# EAGLE board DingDingMusicCircuitBoard 1.0 (EAGLE 7.3.0), part 1 of 2
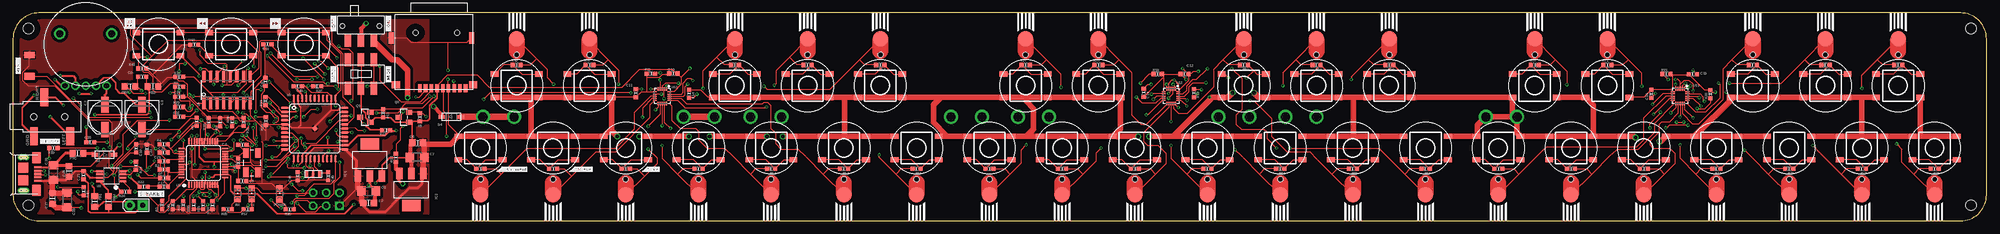
[diagram p4: board, top side]
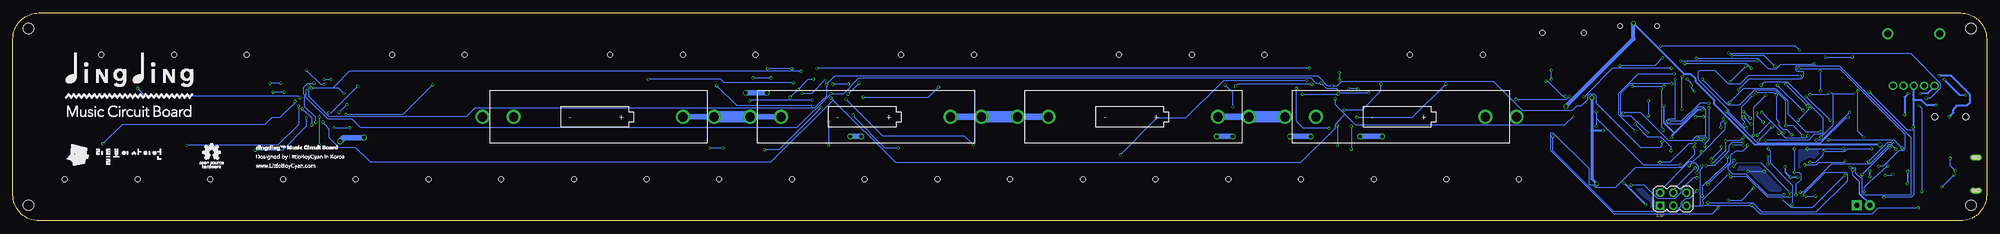
[diagram p5: board, bottom side, seen from below]

Size 380 x 40 mm. Coordinates in mm from the lower left corner, seen from the top.
Outline: 5,0 375,0 arc90 380,5 380,35 arc90 375,40 5,40 arc90 0,35 0,5 arc90 5,0
Copper layers (1*16): Top 0.035mm / dielectric 1.5mm / Bottom 0.035mm
Design rules "SparkFun *": minimum track width 5mil, minimum drill 12mil, track to track 5mil, track to pad 8mil, pad to pad 8mil, via to via 5mil, smd to smd 8mil, copper to edge 50mil, drill to drill 8mil, minimum pad ring 12mil, minimum via ring 5mil, stop-mask expansion 4mil, vias tented up to drill 25mil, thermal gap 10mil
Net classes: 2 gnd: width 0.254 mm, drill 0.61 mm, clearance 0.254 mm; 3 usbvcc: width 0.254 mm, drill 0.61 mm, clearance 0.254 mm; 4 aref: width 0.254 mm, drill 0.61 mm, clearance 0.254 mm
Holes 2 mm at 377,37 377,3 3,37 3,3

## Footprints (pad centres in the part's own frame; a part is rotated, then mirrored left to right if it is on the bottom)
AAA_CLIP = drill 1.78: P$1+ -22,0; P$2+ -16,0; P$3- 16.6,0; P$4- 22.6,0
PANASONIC_D = smd 3 x 1.4: + 2.4,0; - -2.4,0
_0805MP = smd 1.2 x 1.3: 1 -1.016,0; 2 1.016,0
_0603MP = smd 0.8 x 0.8: 1 -0.762,0; 2 0.762,0
1206 = smd 1.6 x 1.8: 1 -1.4,0; 2 1.4,0
MICROSD_MSDC-M61408 = smd 0.7 x 1.55: 1 2.2,10.675; 2 1.1,10.675; 3 0,10.675; 4 -1.1,10.675; 5 -2.2,10.675; 6 -3.3,10.675; 7 -4.4,10.675; 8 -5.5,10.675; NOT -6.6,10.675 | smd 1 x 2.22: P$1 -7.75,1; P$2 7.75,1 | smd 1.6 x 1.4: P$3 6.85,10; P$4 -8.05,10 | hole 1: -4.95,0; 3.05,0
SOD-123 = smd 1.2 x 0.7: A 1.85,0; C -1.85,0
SOT223 = smd 1.219 x 2.235: 1 -2.311,-3.099; 2 0,-3.099; 3 2.311,-3.099 | smd 3.6 x 2.2: 4 0,3.099
2X03 = drill 0.95 pad 1.55 octagon: 1 -2.54,-1.27; 2 -2.54,1.27; 3 0,-1.27; 4 0,1.27; 5 2.54,-1.27 | drill 0.95 pad 1.55 square: 6 2.54,1.27
TACTILE_SWITCH_TALL = smd 1.5 x 1: A1 -4.24,-2.25; A2 4.26,-2.25; B1 -4.24,2.25; B2 4.26,2.25
CHIPLED_0805 = smd 1.2 x 1.2: A 0,-1.05; C 0,1.05
SOT23-WIDE@1 = smd 1 x 1.2: 1 -0.95,-1; 2 0.95,-1; 3 0,1
TACT_SWITCH_SMALL = smd 1.3 x 2: P$1 -2,0; P$2 2.1,0
1X02 = drill 1.016 pad 1.88 square: 1 0,0 | drill 1.016 pad 1.88: 2 2.54,0
RDD_TOUCH_PAD = smd 3 x 3: P$1 0,0 | hole 1: 0,3
LQFP48 = smd 1.1 x 0.285: 1 -4.2,2.75; 2 -4.2,2.25; 3 -4.2,1.75; 4 -4.2,1.25; 5 -4.2,0.75; 6 -4.2,0.25; 7 -4.2,-0.25; 8 -4.2,-0.75; 9 -4.2,-1.25; 10 -4.2,-1.75; 11 -4.2,-2.25; 12 -4.2,-2.75; 25 4.2,-2.75; 26 4.2,-2.25; 27 4.2,-1.75; 28 4.2,-1.25; 29 4.2,-0.75; 30 4.2,-0.25; 31 4.2,0.25; 32 4.2,0.75; 33 4.2,1.25; 34 4.2,1.75; 35 4.2,2.25; 36 4.2,2.75 | smd 0.285 x 1.1: 13 -2.75,-4.2; 14 -2.25,-4.2; 15 -1.75,-4.2; 16 -1.25,-4.2; 17 -0.75,-4.2; 18 -0.25,-4.2; 19 0.25,-4.2; 20 0.75,-4.2; 21 1.25,-4.2; 22 1.75,-4.2; 23 2.25,-4.2; 24 2.75,-4.2; 37 2.75,4.2; 38 2.25,4.2; 39 1.75,4.2; 40 1.25,4.2; 41 0.75,4.2; 42 0.25,4.2; 43 -0.25,4.2; 44 -0.75,4.2; 45 -1.25,4.2; 46 -1.75,4.2; 47 -2.25,4.2 | smd 0.28 x 1.1: 48 -2.75,4.2
SOIC16 = smd 0.6 x 2.2: 1 -4.445,-2.6; 2 -3.175,-2.6; 3 -1.905,-2.6; 4 -0.635,-2.6; 5 0.635,-2.6; 6 1.905,-2.6; 7 3.175,-2.6; 8 4.445,-2.6; 9 4.445,2.6; 10 3.175,2.6; 11 1.905,2.6; 12 0.635,2.6; 13 -0.635,2.6; 14 -1.905,2.6; 15 -3.175,2.6; 16 -4.445,2.6
MSOP8_0.65MM = smd 0.4 x 1.4: 1 -0.975,-2.2; 2 -0.325,-2.2; 3 0.325,-2.2; 4 0.975,-2.2; 5 0.975,2.2; 6 0.325,2.2; 7 -0.325,2.2; 8 -0.975,2.2
TQFP44-PAD = smd 1.4 x 0.45: 1 -5.8,4; 2 -5.8,3.2; 3 -5.8,2.4; 4 -5.8,1.6; 5 -5.8,0.8; 6 -5.8,0; 7 -5.8,-0.8; 8 -5.8,-1.6; 9 -5.8,-2.4; 10 -5.8,-3.2; 11 -5.8,-4; 23 5.8,-4; 24 5.8,-3.2; 25 5.8,-2.4; 26 5.8,-1.6; 27 5.8,-0.8; 28 5.8,0; 29 5.8,0.8; 30 5.8,1.6; 31 5.8,2.4; 32 5.8,3.2; 33 5.8,4 | smd 0.45 x 1.4: 12 -4,-5.8; 13 -3.2,-5.8; 14 -2.4,-5.8; 15 -1.6,-5.8; 16 -0.8,-5.8; 17 0,-5.8; 18 0.8,-5.8; 19 1.6,-5.8; 20 2.4,-5.8; 21 3.2,-5.8; 22 4,-5.8; 34 4,5.8; 35 3.2,5.8; 36 2.4,5.8; 37 1.6,5.8; 38 0.8,5.8; 39 0,5.8; 40 -0.8,5.8; 41 -1.6,5.8; 42 -2.4,5.8; 43 -3.2,5.8; 44 -4,5.8 | smd 1 x 1: P$1 0,0
QFN20_3MM_NOTHERMAL = smd 0.7 x 0.2: 1 -1.4,0.8; 2 -1.4,0.4; 3 -1.4,0; 4 -1.4,-0.4; 5 -1.4,-0.8; 11 1.4,-0.8; 12 1.4,-0.4; 13 1.4,0; 14 1.4,0.4; 15 1.4,0.8 | smd 0.2 x 0.7: 6 -0.8,-1.4; 7 -0.4,-1.4; 8 0,-1.4; 9 0.4,-1.4; 10 0.8,-1.4; 16 0.8,1.4; 17 0.4,1.4; 18 0,1.4; 19 -0.4,1.4; 20 -0.8,1.4
SOUND_VOLUME = drill 1: 1A -4,0; 2 -2,0; 3 4,0; B 0,0; C 2,0 | drill 1.4: P$6 -5,10; P$7 5,10
SWITCH_CTS-2235S = smd 1.2 x 2.5: P$1 -2.5,3; P$2 0,3; P$3 2.5,3; P$4 -2.5,-2.5; P$5 0,-2.5; P$6 2.5,-2.5
SWITCH_CTS-1280 = smd 1.2 x 2.5: P$1 -2.5,-2.25; P$2 0,-2.25; P$3 2.5,-2.25 | hole 0.9: -3.55,0.5; 3.55,0.5
MURATA_CRYSTAL = smd 0.4 x 1.3: 0 0,0; 1 -1.2,0; 2 1.2,0
MICRO_USB = smd 0.4 x 1.35: D+ 0,-2.73; D- 0.65,-2.73; GND -1.3,-2.73; P$8 -0.65,-2.73; VBUS 1.3,-2.73 | smd 1.9 x 1.9: P$1 -1.2,0; P$2 1.2,0 | smd 2.1 x 1.6: P$3 -3.1,-2.55; P$4 3.1,-2.55 | drill 0.5 pad 1.1 long: P$5 3.2,0; P$6 -3.2,0 | hole 0.5: -3.2,0; -3.2,0.25; -3.2,0.5; -3.2,-0.25; -3.2,-0.5; 3.2,0; 3.2,0.25; 3.2,0.49; 3.2,-0.25; 3.2,-0.49
EARPHONE_PAC = smd 1.5 x 3.5: GND -3.95,-3.75; LEFT 3.05,-3.75; RIGHT -2,3.75 | hole 1.2: -4,0; 2,0
CRYSTAL-SMD-5X3 = smd 1.9 x 1.1: 1 -1.85,-1.15; 2 1.85,-1.15; 3 1.85,1.15; 4 -1.85,1.15

## Placement (x,y rotation side)
AAA01  AAA_CLIP  [AAA_CLIP]  112.5,20 0 top
AAA02  AAA_CLIP  [AAA_CLIP]  164,20 0 top
AAA03  AAA_CLIP  [AAA_CLIP]  215.5,20 0 top
AAA04  AAA_CLIP  [AAA_CLIP]  267,20 0 top
C1  220uF  [PANASONIC_D]  24.83,19.94 270 top
C2  220uF  [PANASONIC_D]  17.71,19.94 270 top
C3  0.1uF  [_0805MP]  68.5,3.4 180 top
C4  22pF  [_0603MP]  44.18,14.61 0 top
C5  22pF  [_0603MP]  44.15,7.66 0 top
C6  0.1uF  [_0805MP]  77.9,15 0 top
C7  10uF  [1206]  77.8,12.2 180 top
C8  0.1µF  [_0603MP]  24.88,27.71 0 top
C9  10uF  [1206]  68.5,5.7 0 top
C10  0.1uF  [_0603MP]  127.15,28.35 180 top
C11  0.1uF  [_0603MP]  119.92,24.57 270 top
C12  0.1uF  [_0603MP]  225.6,28.25 180 top
C13  0.1uF  [_0603MP]  217.72,24.63 270 top
C14  0.1uF  [_0603MP]  315.45,24.45 90 top
C15  0.1uF  [_0603MP]  323.47,28.23 180 top
C16  1uF  [_0603MP]  14.91,15.14 180 top
C17  1uF  [_0603MP]  29.06,6.56 0 top
C18  10uF  [_0603MP]  23.7,13.93 90 top
C19  10µF  [_0603MP]  31.98,23.86 0 top
C20  10uF  [1206]  7.8,9.3 90 top
C21  0.01uF  [_0603MP]  29.04,11.49 0 top
C22  0.01uF  [_0603MP]  29.05,13.15 180 top
C23  220pF  [_0603MP]  13.57,8.78 90 top
C24  220pF  [_0603MP]  25.8,13.9 90 top
C25  0.1uF  [_0805MP]  10.8,9.5 270 top
C26  0.1µF  [_0603MP]  30.77,3.01 270 top
C27  0.1uF  [_0805MP]  7.6,4.3 90 top
C28  10uF  [1206]  10.4,4 270 top
C45  22pF  [_0603MP]  54.83,8.55 270 top
C46  22pF  [_0603MP]  60.72,8.55 270 top
C47  1uF  [_0603MP]  48.61,26.75 270 top
C48  0.1uF  [_0603MP]  54.86,25.92 180 top
CN1  2908-05WB-M6  [MICROSD_MSDC-M61408]  80.56,36.19 180 top
D3  SS14  [SOD-123]  17.6,12.7 180 top
D4  1N4007  [SOD-123]  84.4,20 0 top
FB1  Ferrite  [_0805MP]  15.73,3.71 270 top
FB2  FERITTE  [_0805MP]  22.54,25.86 0 top
FB3  FERITTE  [_0805MP]  26.96,25.84 180 top
FB4  Ferrite  [_0805MP]  18.39,3.71 270 top
IC1  1117-1.8V  [SOT223]  68.7,11.7 0 top
IC2  1117-3.3V  [SOT223]  76.7,6 180 top
ICSP  ICSP  [2X03]  60.32,4.14 180 bottom
KEY00  SWITCH-MOMENTARY-2  [TACTILE_SWITCH_TALL]  90,14 0 top
KEY01  SWITCH-MOMENTARY-2  [TACTILE_SWITCH_TALL]  97,26 180 top
KEY02  SWITCH-MOMENTARY-2  [TACTILE_SWITCH_TALL]  104,14 0 top
KEY03  SWITCH-MOMENTARY-2  [TACTILE_SWITCH_TALL]  111,26 180 top
KEY04  SWITCH-MOMENTARY-2  [TACTILE_SWITCH_TALL]  118,14 0 top
KEY05  SWITCH-MOMENTARY-2  [TACTILE_SWITCH_TALL]  132,14 0 top
KEY06  SWITCH-MOMENTARY-2  [TACTILE_SWITCH_TALL]  139,26 180 top
KEY07  SWITCH-MOMENTARY-2  [TACTILE_SWITCH_TALL]  146,14 0 top
KEY08  SWITCH-MOMENTARY-2  [TACTILE_SWITCH_TALL]  153,26 180 top
KEY09  SWITCH-MOMENTARY-2  [TACTILE_SWITCH_TALL]  160,14 0 top
KEY10  SWITCH-MOMENTARY-2  [TACTILE_SWITCH_TALL]  167,26 180 top
KEY11  SWITCH-MOMENTARY-2  [TACTILE_SWITCH_TALL]  174,14 0 top
KEY12  SWITCH-MOMENTARY-2  [TACTILE_SWITCH_TALL]  188,14 0 top
KEY13  SWITCH-MOMENTARY-2  [TACTILE_SWITCH_TALL]  195,26 180 top
KEY14  SWITCH-MOMENTARY-2  [TACTILE_SWITCH_TALL]  202,14 0 top
KEY15  SWITCH-MOMENTARY-2  [TACTILE_SWITCH_TALL]  209,26 180 top
KEY16  SWITCH-MOMENTARY-2  [TACTILE_SWITCH_TALL]  216,14 0 top
KEY17  SWITCH-MOMENTARY-2  [TACTILE_SWITCH_TALL]  230,14 0 top
KEY18  SWITCH-MOMENTARY-2  [TACTILE_SWITCH_TALL]  237,26 180 top
KEY19  SWITCH-MOMENTARY-2  [TACTILE_SWITCH_TALL]  244,14 0 top
KEY20  SWITCH-MOMENTARY-2  [TACTILE_SWITCH_TALL]  251,26 180 top
KEY21  SWITCH-MOMENTARY-2  [TACTILE_SWITCH_TALL]  258,14 0 top
KEY22  SWITCH-MOMENTARY-2  [TACTILE_SWITCH_TALL]  265,26 180 top
KEY23  SWITCH-MOMENTARY-2  [TACTILE_SWITCH_TALL]  272,14 0 top
KEY24  SWITCH-MOMENTARY-2  [TACTILE_SWITCH_TALL]  286,14 0 top
KEY25  SWITCH-MOMENTARY-2  [TACTILE_SWITCH_TALL]  293,26 180 top
KEY26  SWITCH-MOMENTARY-2  [TACTILE_SWITCH_TALL]  300,14 0 top
KEY27  SWITCH-MOMENTARY-2  [TACTILE_SWITCH_TALL]  307,26 180 top
KEY28  SWITCH-MOMENTARY-2  [TACTILE_SWITCH_TALL]  314,14 0 top
KEY29  SWITCH-MOMENTARY-2  [TACTILE_SWITCH_TALL]  328,14 0 top
KEY30  SWITCH-MOMENTARY-2  [TACTILE_SWITCH_TALL]  335,26 180 top
KEY31  SWITCH-MOMENTARY-2  [TACTILE_SWITCH_TALL]  342,14 0 top
KEY32  SWITCH-MOMENTARY-2  [TACTILE_SWITCH_TALL]  349,26 180 top
KEY33  SWITCH-MOMENTARY-2  [TACTILE_SWITCH_TALL]  356,14 0 top
KEY34  SWITCH-MOMENTARY-2  [TACTILE_SWITCH_TALL]  363,26 180 top
KEY35  SWITCH-MOMENTARY-2  [TACTILE_SWITCH_TALL]  370,14 0 top
POWER  Green  [CHIPLED_0805]  51.31,5.16 0 top
PTC  500mA  [_0805MP]  12.5,13 180 top
Q1  BSS138  [SOT23-WIDE@1]  67.83,19.94 90 top
Q2  BSS138  [SOT23-WIDE@1]  75.28,19.94 90 top
R1  1M  [_0603MP]  43.38,11.19 90 top
R2  75K  [_0603MP]  28.7,3.04 90 top
R3  20  [_0603MP]  29.05,9.88 180 top
R4  20  [_0603MP]  29.04,14.74 180 top
R5  10K  [_0603MP]  78.34,19.91 270 top
R6  100  [_0603MP]  35.36,19.04 270 top
R7  100  [_0603MP]  29.08,8.24 0 top
R8  75K  [_0603MP]  39.9,19 90 top
R9  100K  [_0603MP]  32,25.8 180 top
R10  75K  [_0603MP]  44.42,19.03 90 top
R11  10K  [_0603MP]  71.27,20.67 270 top
R12  10K  [_0603MP]  71.82,17.43 0 top
R13  10K  [_0603MP]  73.72,12.13 270 top
R14  75K  [_0603MP]  130.17,24.43 270 top
R15  100K  [_0603MP]  122.82,28.33 0 top
R16  100K  [_0603MP]  32,27.7 180 top
R17  2.4k  [_0603MP]  45.19,2.2 0 top
R18  75K  [_0603MP]  220.42,28.27 180 top
R19  100K  [_0603MP]  227.37,24.57 270 top
R20  75K  [_0603MP]  326.82,24.37 270 top
R21  100K  [_0603MP]  318.37,28.27 180 top
R22  100  [_0603MP]  25.19,6.55 180 top
R23  100  [_0603MP]  23.68,10.58 270 top
R24  10K  [_0603MP]  21.65,5.56 0 top
R25  10K  [_0603MP]  36.6,3 90 top
R26  10K  [_0603MP]  34.8,3 90 top
R27  10K  [_0603MP]  32.8,3 270 top
R28  75K  [_0603MP]  42.2,19 90 top
R29  100K  [_0603MP]  32,21.9 0 top
R30  75K  [_0603MP]  37.7,19 90 top
R31  75K  [_0603MP]  48.7,19.2 270 top
R32  100K  [_0603MP]  32,20 0 top
R33  75k  [_0603MP]  48.6,23.05 270 top
R34  75K  [_0603MP]  38.4,3 90 top
R35  2.4k  [_0603MP]  41.32,2.2 0 top
R36  2.4k  [_0603MP]  53.3,2.2 180 top
R37  75K  [_0603MP]  58.6,25.9 180 top
R39  22  [_0603MP]  7.8,14 180 top
R40  22  [_0603MP]  13.6,5.7 90 top
R41  10k  [_0603MP]  24.9,29.3 180 top
R42  10k  [_0603MP]  34.9,33.9 0 top
R43  10k  [_0603MP]  49,34 180 top
R44  1M  [_0603MP]  90,10 0 top
R45  1M  [_0603MP]  97,30 0 top
R46  1M  [_0603MP]  104,10 0 top
R47  1M  [_0603MP]  111,30 0 top
R48  1M  [_0603MP]  118,10 0 top
R49  1M  [_0603MP]  132,10 180 top
R50  1M  [_0603MP]  139,30 180 top
R51  1M  [_0603MP]  146,10 180 top
R52  1M  [_0603MP]  153,30 180 top
R53  1M  [_0603MP]  160,10 180 top
R54  1M  [_0603MP]  167,30 180 top
R55  1M  [_0603MP]  174,10 180 top
R56  1M  [_0603MP]  188,10 0 top
R57  1M  [_0603MP]  195,30 0 top
R58  1M  [_0603MP]  202,10 0 top
R59  1M  [_0603MP]  209,30 0 top
R60  1M  [_0603MP]  216,10 0 top
R61  1M  [_0603MP]  230,10 180 top
R62  1M  [_0603MP]  237,30 180 top
R63  1M  [_0603MP]  244,10 180 top
R64  1M  [_0603MP]  251,30 180 top
R65  1M  [_0603MP]  258,10 180 top
R66  1M  [_0603MP]  265,30 180 top
R67  1M  [_0603MP]  272,10 180 top
R68  1M  [_0603MP]  286,10 0 top
R69  1M  [_0603MP]  293,30 0 top
R70  1M  [_0603MP]  300,10 0 top
R71  1M  [_0603MP]  307,30 0 top
R72  1M  [_0603MP]  314,10 0 top
R73  1M  [_0603MP]  328,10 180 top
R74  1M  [_0603MP]  335,30 180 top
R75  1M  [_0603MP]  342,10 180 top
R76  1M  [_0603MP]  349,30 180 top
R77  1M  [_0603MP]  356,10 180 top
R78  1M  [_0603MP]  363,30 180 top
R79  1M  [_0603MP]  370,10 180 top
RESET  TACT_SWITCHSMALL  [TACT_SWITCH_SMALL]  3.2,29.9 270 top
RX  Yellow  [CHIPLED_0805]  43.23,5.2 0 top
S2  SWITCH-MOMENTARY-2  [TACTILE_SWITCH_TALL]  56,34 0 top
S3  SWITCH-MOMENTARY-2  [TACTILE_SWITCH_TALL]  42,34 0 top
S4  SWITCH-MOMENTARY-2  [TACTILE_SWITCH_TALL]  28,34 0 top
SPEAKER  M02PTH  [1X02]  25,3 180 top
TOUCH00  [RDD_TOUCH_PAD]  90,5 0 top
TOUCH01  [RDD_TOUCH_PAD]  97,35 180 top
TOUCH02  [RDD_TOUCH_PAD]  104,5 0 top
TOUCH03  [RDD_TOUCH_PAD]  111,35 180 top
TOUCH04  [RDD_TOUCH_PAD]  118,5 0 top
TOUCH05  [RDD_TOUCH_PAD]  132,5 0 top
TOUCH06  [RDD_TOUCH_PAD]  139,35 180 top
TOUCH07  [RDD_TOUCH_PAD]  146,5 0 top
TOUCH08  [RDD_TOUCH_PAD]  153,35 180 top
TOUCH09  [RDD_TOUCH_PAD]  160,5 0 top
TOUCH10  [RDD_TOUCH_PAD]  167,35 180 top
TOUCH11  [RDD_TOUCH_PAD]  174,5 0 top
TOUCH12  [RDD_TOUCH_PAD]  188,5 0 top
TOUCH13  [RDD_TOUCH_PAD]  195,35 180 top
TOUCH14  [RDD_TOUCH_PAD]  202,5 0 top
TOUCH15  [RDD_TOUCH_PAD]  209,35 180 top
TOUCH16  [RDD_TOUCH_PAD]  216,5 0 top
TOUCH17  [RDD_TOUCH_PAD]  230,5 0 top
TOUCH18  [RDD_TOUCH_PAD]  237,35 180 top
TOUCH19  [RDD_TOUCH_PAD]  244,5 0 top
TOUCH20  [RDD_TOUCH_PAD]  251,35 180 top
TOUCH21  [RDD_TOUCH_PAD]  258,5 0 top
TOUCH22  [RDD_TOUCH_PAD]  265,35 180 top
TOUCH23  [RDD_TOUCH_PAD]  272,5 0 top
TOUCH24  [RDD_TOUCH_PAD]  286,5 0 top
TOUCH25  [RDD_TOUCH_PAD]  293,35 180 top
TOUCH26  [RDD_TOUCH_PAD]  300,5 0 top
TOUCH27  [RDD_TOUCH_PAD]  307,35 180 top
TOUCH28  [RDD_TOUCH_PAD]  314,5 0 top
TOUCH29  [RDD_TOUCH_PAD]  328,5 0 top
TOUCH30  [RDD_TOUCH_PAD]  335,35 180 top
TOUCH31  [RDD_TOUCH_PAD]  342,5 0 top
TOUCH32  [RDD_TOUCH_PAD]  349,35 180 top
TOUCH33  [RDD_TOUCH_PAD]  356,5 0 top
TOUCH34  [RDD_TOUCH_PAD]  363,35 180 top
TOUCH35  [RDD_TOUCH_PAD]  370,5 0 top
TX  Yellow  [CHIPLED_0805]  45.98,5.2 0 top
U3  VS1053B  [LQFP48]  36.66,11.12 90 top
U5  74HC4050D  [SOIC16]  41.22,25.17 0 top
U8  PAM8302  [MSOP8_0.65MM]  18.93,8.6 90 top
U9  ATMEGA32U4  [TQFP44-PAD]  58.09,17.76 0 top
U11  [QFN20_3MM_NOTHERMAL]  125,24 270 top
U12  [QFN20_3MM_NOTHERMAL]  222.98,24.01 270 top
U13  [QFN20_3MM_NOTHERMAL]  321,24.01 270 top
U$32  SOUND_VOLUME  [SOUND_VOLUME]  14,26 0 top
U$41  [DD_SILK_FUNTION]  21.5,37 0 top
U$42  SWITCH_SK-02ACTS-2235S  [SWITCH_CTS-2235S]  67,28 0 top
U$44  SWITCH_SK-02ACTS-1280  [SWITCH_CTS-1280]  67,37 0 top
U$47  MURATA_CRYSTAL  [MURATA_CRYSTAL]  57.8,9 0 top
U$61  [DD_SILK_BACK]  35.5,37 0 top
U$62  [DD_SILK_FORWARD]  49.5,37 0 top
U$63  [DD_SILK_RESET]  1.51,28.35 90 top
U$70  MICRO_USB  [MICRO_USB]  2,9 90 top
U$80  EARPHONE_DEV  [EARPHONE_PAC]  8,20 0 top
U$81  [DD_SILK_STEREO]  5.3,14.8 0 top
U$82  [DD_SILK_ON]  72.8,36.5 90 top
U$83  [DD_SILK_OFF]  62.2,36.5 90 top
U$84  [DD_SILK_MIDI]  72.8,26.7 90 top
U$85  [DD_SILK_MP3]  62.2,26.7 90 top
U$86  [DD_SILK_INST]  93,9.4 0 top
U$87  [DD_SILK_OCTAVE]  107,9.4 0 top
U$88  [DD_SILK_SCALE]  121,9.4 0 top
U$89  [DD_SILK_SPEAKER]  24.1,4.6 0 top
U$90  [DD_SILK_FINGER_LINE]  90,0 0 top
U$91  [DD_SILK_FINGER_LINE]  104,0 0 top
U$92  [DD_SILK_FINGER_LINE]  118,0 0 top
U$93  [DD_SILK_FINGER_LINE]  132,0 0 top
U$94  [DD_SILK_FINGER_LINE]  146,0 0 top
U$95  [DD_SILK_FINGER_LINE]  160,0 0 top
U$96  [DD_SILK_FINGER_LINE]  174,0 0 top
U$97  [DD_SILK_FINGER_LINE]  188,0 0 top
U$98  [DD_SILK_FINGER_LINE]  202,0 0 top
U$99  [DD_SILK_FINGER_LINE]  216,0 0 top
U$100  [DD_SILK_FINGER_LINE]  230,0 0 top
U$101  [DD_SILK_FINGER_LINE]  244,0 0 top
U$102  [DD_SILK_FINGER_LINE]  258,0 0 top
U$103  [DD_SILK_FINGER_LINE]  272,0 0 top
U$104  [DD_SILK_FINGER_LINE]  286,0 0 top
U$105  [DD_SILK_FINGER_LINE]  300,0 0 top
U$106  [DD_SILK_FINGER_LINE]  314,0 0 top
U$107  [DD_SILK_FINGER_LINE]  328,0 0 top
U$108  [DD_SILK_FINGER_LINE]  342,0 0 top
U$109  [DD_SILK_FINGER_LINE]  356,0 0 top
U$110  [DD_SILK_FINGER_LINE]  370,0 0 top
U$111  [DD_SILK_FINGER_LINE]  97,40 180 top
U$112  [DD_SILK_FINGER_LINE]  111,40 180 top
U$113  [DD_SILK_FINGER_LINE]  139,40 180 top
U$114  [DD_SILK_FINGER_LINE]  153,40 180 top
U$115  [DD_SILK_FINGER_LINE]  167,40 180 top
U$116  [DD_SILK_FINGER_LINE]  195,40 180 top
U$117  [DD_SILK_FINGER_LINE]  209,40 180 top
U$118  [DD_SILK_FINGER_LINE]  237,40 180 top
U$119  [DD_SILK_FINGER_LINE]  251,40 180 top
U$120  [DD_SILK_FINGER_LINE]  265,40 180 top
U$121  [DD_SILK_FINGER_LINE]  293,40 180 top
U$122  [DD_SILK_FINGER_LINE]  307,40 180 top
U$123  [DD_SILK_FINGER_LINE]  335,40 180 top
U$124  [DD_SILK_FINGER_LINE]  349,40 180 top
U$125  [DD_SILK_FINGER_LINE]  363,40 180 top
U$126  [DD_SILK_LOGO01]  370,20 0 bottom
U$127  [DD_SILK_LOGO02]  370,10 0 bottom
Y1  12.288Mhz  [CRYSTAL-SMD-5X3]  46.02,11.19 90 top